# Altium schematic sheet RYA_KiteUp.SchDoc: Kite Up
size A3; Author: PIF.HW Team; DrawnBy: PIF.HW Team; Organization: Pay It Forward club; Address1: 304B1, HCMC; Address2: 268 Ly Thuong Kiet street; Address3: Ward 14, District 10; Address4: Ho Chi Minh city, Vietnam; DocumentNumber: 1; Revision: v1.3; SheetNumber: 1; SheetTotal: 2; ProjectTitle: RYA_KiteUp.PrjPcb
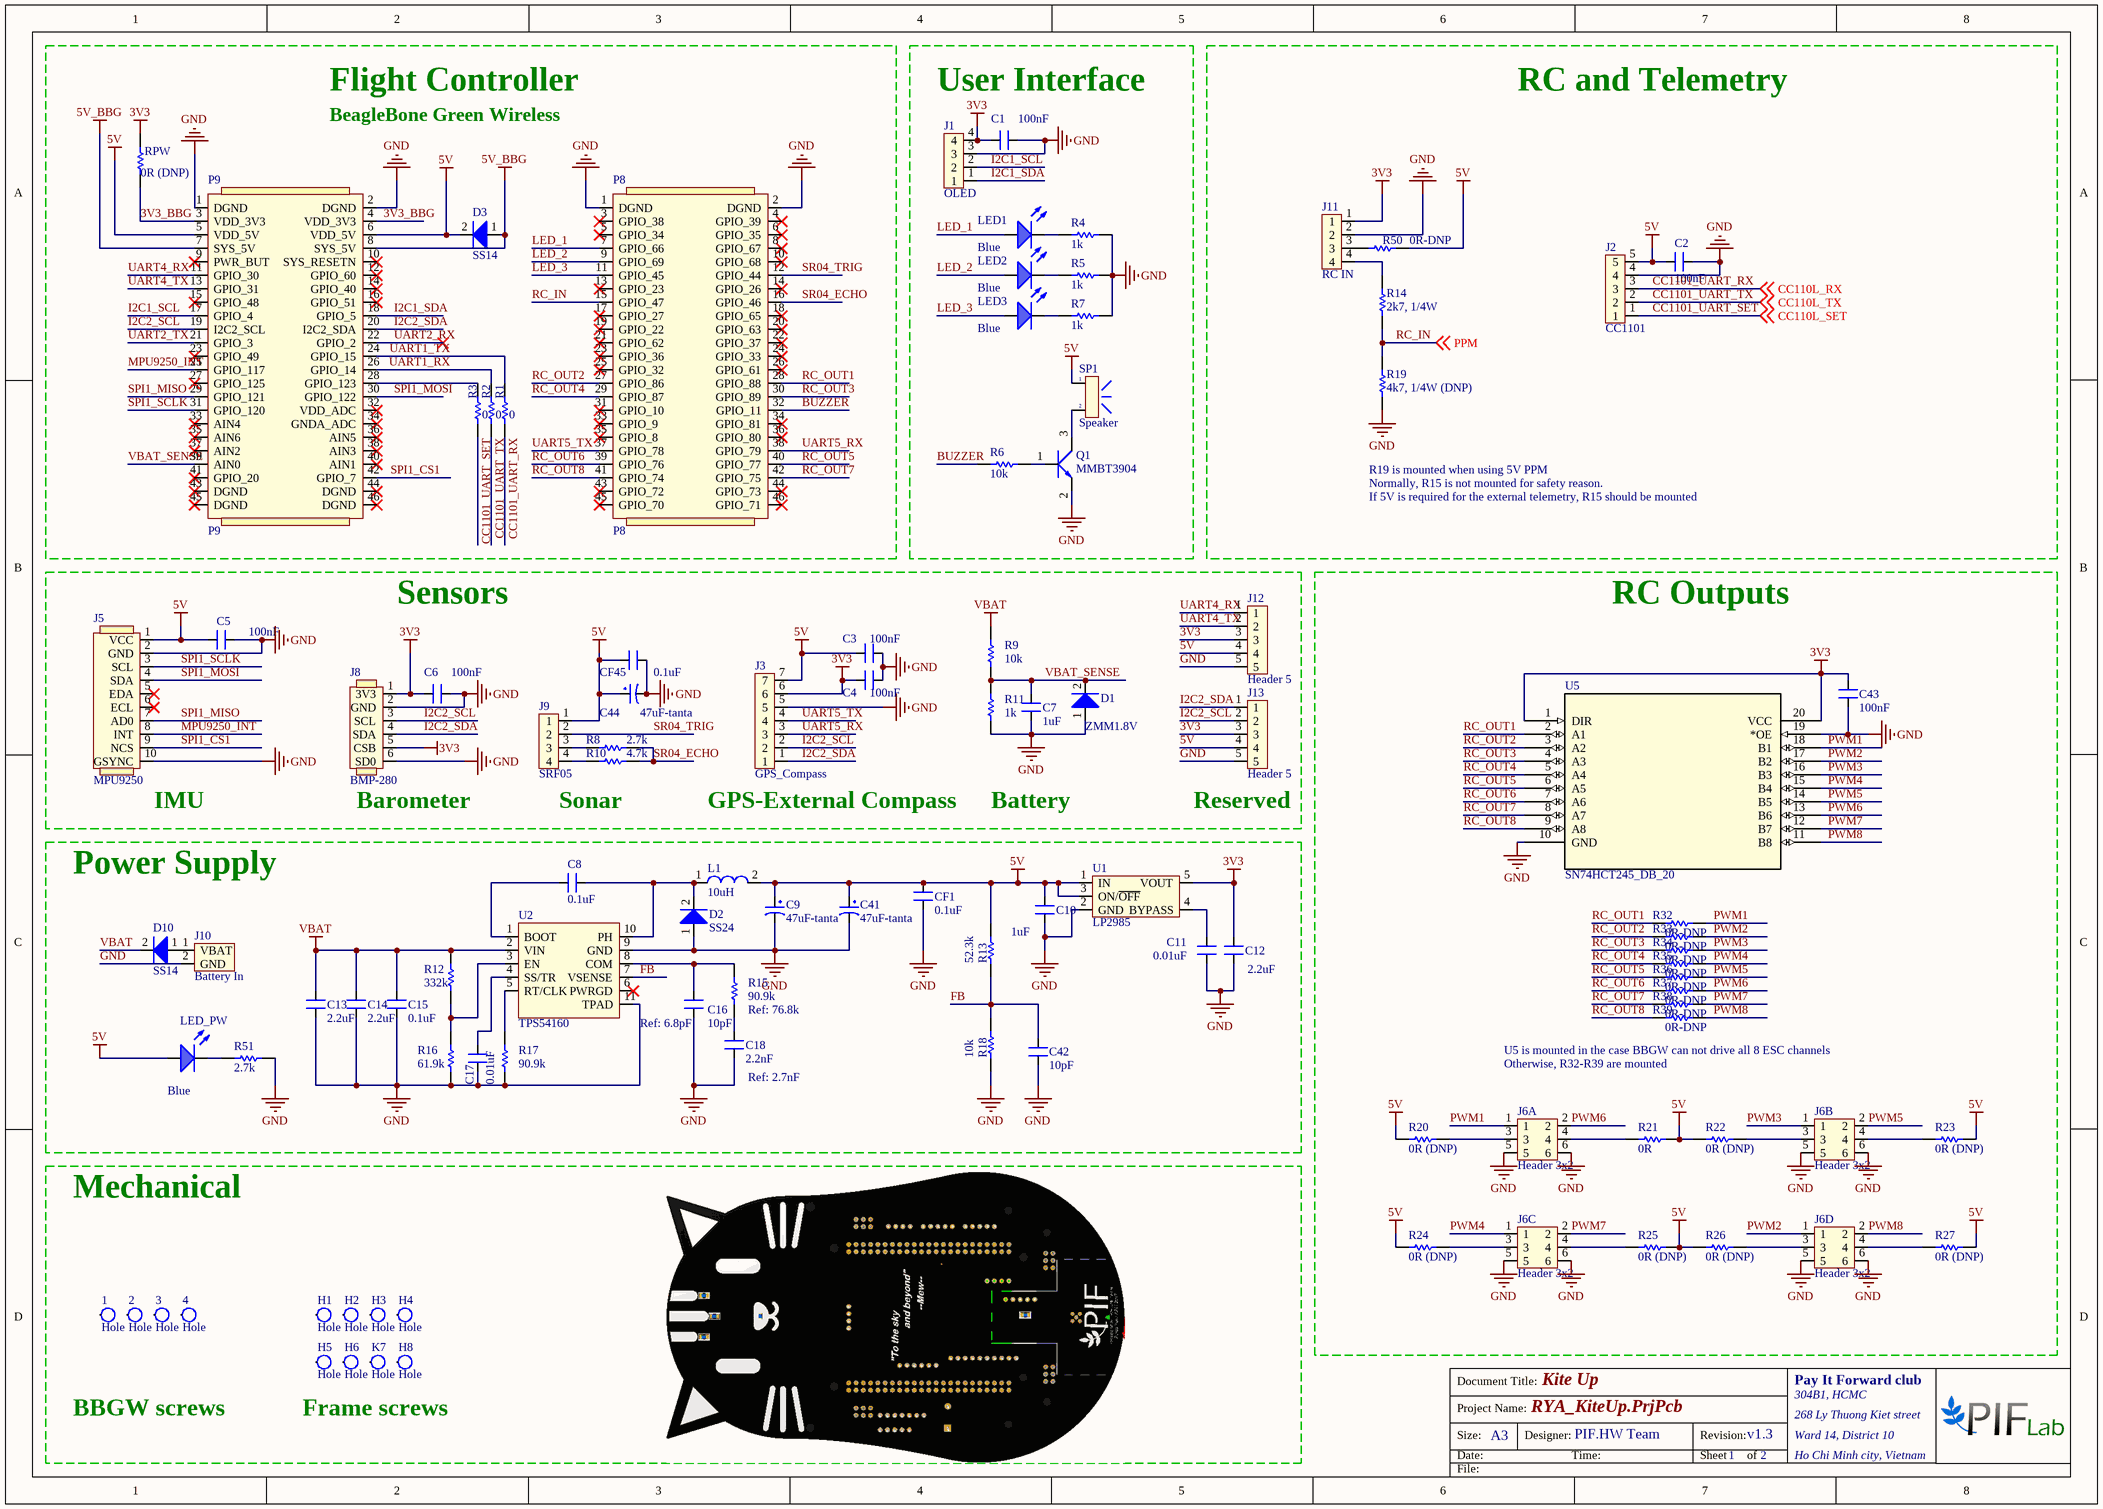
[diagram p0: RYA_KiteUp.SchDoc]

## Parts
1  Hole  [Screw_3.2]  (no BOM)
2  Hole  [Screw_3.2]  (no BOM)
3  Hole  [Screw_3.2]  (no BOM)
4  Hole  [Screw_3.2]  (no BOM)
C1  100nF  [CAP 0603(1508)]  (no BOM)
C2  100nF  [CAP 0603(1508)]  (no BOM)
C3  100nF  [CAP 0603(1508)]  (no BOM)
C4  100nF  [CAP 0603(1508)]  (no BOM)
C5  100nF  [CAP 0603(1508)]
C6  100nF  [CAP 0603(1508)]
C7  1uF  [CAP 0603(1508)]
C8  0.1uF  [CAP 0603(1508)]
C9  47uF-tanta  [CAP_TAN_2312(6032)]
C10  1uF  [CAP 0603(1508)]
C11  0.01uF  [CAP 0603(1508)]
C12  2.2uF  [CAP 0603(1508)]
C13  2.2uF  [CAP 0603(1508)]
C14  2.2uF  [CAP 0603(1508)]
C15  0.1uF  [CAP 0603(1508)]
C16  10pF  [CAP 0603(1508)]
C17  0.01uF  [CAP 0603(1508)]
C18  2.2nF  [CAP 0603(1508)]
C41  47uF-tanta  [CAP_TAN_2312(6032)]  (no BOM)
C42  10pF  [CAP 0603(1508)]  (no BOM)
C43  100nF  [CAP 0603(1508)]
C44  47uF-tanta  [CAP_TAN_2312(6032)]  (no BOM)
CF1  0.1uF  [CAP 0603(1508)]
CF45  0.1uF  [CAP 0603(1508)]
D1  ZMM1.8V  [ZMM1.8V]
D2  SS24  [SS24]
D3  SS14  [SS24]
D10  SS14  [SS24]
H1  Hole  [Screw_3.2]  (no BOM)
H2  Hole  [Screw_3.2]  (no BOM)
H3  Hole  [Screw_3.2]  (no BOM)
H4  Hole  [Screw_3.2]  (no BOM)
H5  Hole  [Screw_3.2]  (no BOM)
H6  Hole  [Screw_3.2]  (no BOM)
H8  Hole  [Screw_3.2]  (no BOM)
J1  OLED  [Header 4]  (no BOM)
J2  CC1101  [Header 5]  (no BOM)
J3  GPS_Compass  [Header 7]  (no BOM)
J5  MPU9250  [Header 10]
J6A  Header 3x2  [Header 3x2]
J6B  Header 3x2  [Header 3x2]
J6C  Header 3x2  [Header 3x2]
J6D  Header 3x2  [Header 3x2]
J8  BMP-280  [Header 6]
J9  SRF05  [Header 4]
J10  Battery In  [BATTERYPAD]
J11  RC IN  [Header 4]  (no BOM)
J12  Header 5  [Header 5]  (no BOM)
J13  Header 5  [Header 5]  (no BOM)
K7  Hole  [Screw_3.2]  (no BOM)
L1  10uH  [Inductor SMD 48x48x28mm]
LED1  value Blue  [LED0805BLUE]  (hidden comment: LED_BLUE)
LED2  value Blue  [LED0805BLUE]  (hidden comment: LED_BLUE)
LED3  value Blue  [LED0805BLUE]  (hidden comment: LED_BLUE)
LED_PW  value Blue  [LED0805BLUE]  (hidden comment: LED_BLUE)
P8  P8  [Header 46]
P9  P9  [Header 46]
Q1  MMBT3904  [MMBT3904]
R1  0  [RES 0603(1508)]  (no BOM)
R2  0  [RES 0603(1508)]  (no BOM)
R3  0  [RES 0603(1508)]  (no BOM)
R4  1k  [RES 0603(1508)]
R5  1k  [RES 0603(1508)]
R6  10k  [RES 0603(1508)]
R7  1k  [RES 0603(1508)]
R8  2.7k  [RES 0603(1508)]
R9  10k  [RES 0603(1508)]
R10  4.7k  [RES 0603(1508)]
R11  1k  [RES 0603(1508)]
R12  332k  [RES 0603(1508)]
R13  52.3k  [RES 0603(1508)]
R14  2k7, 1/4W  [RES 0603(1508)]
R15  90.9k  [RES 0603(1508)]
R16  61.9k  [RES 0603(1508)]
R17  90.9k  [RES 0603(1508)]
R18  10k  [RES 0603(1508)]
R19  4k7, 1/4W (DNP)  [RES 0603(1508)]  (no BOM)
R20  0R (DNP)  [RES 0603(1508)]  (no BOM)
R21  0R  [RES 0603(1508)]  (no BOM)
R22  0R (DNP)  [RES 0603(1508)]  (no BOM)
R23  0R (DNP)  [RES 0603(1508)]  (no BOM)
R24  0R (DNP)  [RES 0603(1508)]  (no BOM)
R25  0R (DNP)  [RES 0603(1508)]  (no BOM)
R26  0R (DNP)  [RES 0603(1508)]  (no BOM)
R27  0R (DNP)  [RES 0603(1508)]  (no BOM)
R32  0R-DNP  [RES 0603(1508)]  (no BOM)
R33  0R-DNP  [RES 0603(1508)]  (no BOM)
R34  0R-DNP  [RES 0603(1508)]  (no BOM)
R35  0R-DNP  [RES 0603(1508)]  (no BOM)
R36  0R-DNP  [RES 0603(1508)]  (no BOM)
R37  0R-DNP  [RES 0603(1508)]  (no BOM)
R38  0R-DNP  [RES 0603(1508)]  (no BOM)
R39  0R-DNP  [RES 0603(1508)]  (no BOM)
R50  0R-DNP  [RES 0603(1508)]  (no BOM)
R51  2.7k  [RES 0603(1508)]
RPW  0R (DNP)  [RES 0603(1508)]  (no BOM)
SP1  Speaker  [Buzzer]
U1  LP2985  [LP2985]
U2  TPS54160  [TPS54160]
U5  SN74HCT245_DB_20  [DW20]

## Blocks framed on the sheet
Flight Controller: D3 P8 P9 R1-R3 RPW
User Interface: C1 J1 LED1-LED3 Q1 R4-R7 SP1
RC and Telemetry: C2 J2 J11 R14 R19 R50
Sensors: C3-C7 C44 CF45 D1 J3 J5 J8 J9 J12 J13 R8-R11
RC Outputs: C43 J6A J6B J6C J6D R20-R27 R32-R39 U5
Power Supply: C8-C18 C41 C42 CF1 D2 D10 J10 L1 LED_PW R12 R13 R15-R18 R51 U1 U2
Mechanical: 1-4 H1-H6 H8 K7

## Nets
3V3: C1.2 C4.2 C6.1 C12.2 C43.2 J1.4 J3.6 J8.1(3V3) J8.5(CSB) J11.1 J12.3 J13.3 RPW.2 U1.5(VOUT) U5.1(DIR) U5.20(VCC)
5V: C2.2 C3.2 C5.1 C9.1 C10.2 C41.1 C44.1 CF1.2 CF45.2 D3.2(K) J2.5 J3.7 J5.1(VCC) J9.1 J12.4 J13.4 L1.2 LED_PW.1(A) P9.5(VDD_5V) P9.6(VDD_5V) R13.1 R20.2 R21.1 R22.2 R23.1 R24.2 R25.1 R26.2 R27.1 R50.2 SP1.1 U1.1(IN) U1.3(ON/~{OFF})
5V_BBG: D3.1(A) P9.7(SYS_5V) P9.8(SYS_5V)
GND: C1.1 C2.1 C3.1 C4.1 C5.2 C6.2 C7.1 C9.2 C10.1 C11.1 C12.1 C13.1 C14.1 C15.1 C16.1 C17.1 C18.1 C41.2 C42.1 C43.1 C44.2 CF1.1 CF45.1 D1.1(A) D2.1(A) J1.3 J2.4 J3.5 J5.2(GND) J5.10(GSYNC) J6A.5 J6A.6 J6B.5 J6B.6 J6C.5 J6C.6 J6D.5 J6D.6 J8.2(GND) J8.6(SD0) J10.2(GND) J11.2 J12.5 J13.5 P8.1(DGND) P8.2(DGND) P9.1(DGND) P9.2(DGND) Q1.2(E) R4.1 R5.1 R7.1 R11.2 R16.2 R17.2 R18.2 R19.2 R51.1 U1.2(GND) U2.9(GND) U2.11(TPAD) U5.10(GND) U5.19(*OE)
VBAT: C13.2 C14.2 C15.2 D10.2(K) R9.1 R12.1 U2.2(VIN)
3V3_BBG: P9.3(VDD_3V3) P9.4(VDD_3V3) RPW.1
BUZZER: P8.32(GPIO_11) R6.2
CC1101_UART_RX: J2.3 R1.1 ; off-sheet CC110L_RX  [also labelled CC110L_RX]
CC1101_UART_SET: J2.1 R3.1 ; off-sheet CC110L_SET  [also labelled CC110L_SET]
CC1101_UART_TX: J2.2 R2.1 ; off-sheet CC110L_TX  [also labelled CC110L_TX]
FB: C42.2 R13.2 R18.1 U2.7(VSENSE)
I2C1_SCL: J1.2 P9.17(GPIO_4)
I2C1_SDA: J1.1 P9.18(GPIO_5)
I2C2_SCL: J3.2 J8.3(SCL) J13.2 P9.19(I2C2_SCL)
I2C2_SDA: J3.1 J8.4(SDA) J13.1 P9.20(I2C2_SDA)
LED_1: LED1.1(A) P8.7(GPIO_66)
LED_2: LED2.1(A) P8.9(GPIO_69)
LED_3: LED3.1(A) P8.11(GPIO_45)
MPU9250_INT: J5.8(INT) P9.25(GPIO_117)
PWM1: J6A.1 R32.1 U5.18(B1)
PWM2: J6D.1 R33.1 U5.17(B2)
PWM3: J6B.1 R34.1 U5.16(B3)
PWM4: J6C.1 R35.1 U5.15(B4)
PWM5: J6B.2 R36.1 U5.14(B5)
PWM6: J6A.2 R37.1 U5.13(B6)
PWM7: J6C.2 R38.1 U5.12(B7)
PWM8: J6D.2 R39.1 U5.11(B8)
RC_IN: P8.15(GPIO_47) R14.2 R19.1 ; off-sheet PPM  [also labelled PPM]
RC_OUT1: P8.28(GPIO_88) R32.2 U5.2(A1)
RC_OUT2: P8.27(GPIO_86) R33.2 U5.3(A2)
RC_OUT3: P8.30(GPIO_89) R34.2 U5.4(A3)
RC_OUT4: P8.29(GPIO_87) R35.2 U5.5(A4)
RC_OUT5: P8.40(GPIO_77) R36.2 U5.6(A5)
RC_OUT6: P8.39(GPIO_76) R37.2 U5.7(A6)
RC_OUT7: P8.42(GPIO_75) R38.2 U5.8(A7)
RC_OUT8: P8.41(GPIO_74) R39.2 U5.9(A8)
SPI1_CS1: J5.9(NCS) P9.42(GPIO_7)
SPI1_MISO: J5.7(AD0) P9.29(GPIO_121)
SPI1_MOSI: J5.4(SDA) P9.30(GPIO_122)
SPI1_SCLK: J5.3(SCL) P9.31(GPIO_120)
SR04_ECHO: P8.16(GPIO_46) R8.1 R10.1
SR04_TRIG: J9.2 P8.12(GPIO_44)
UART1_RX: P9.26(GPIO_14) R2.2
UART1_TX: P9.24(GPIO_15) R1.2
UART2_RX: P9.22(GPIO_2)
UART2_TX: P9.21(GPIO_3)
UART4_RX: J12.1 P9.11(GPIO_30)
UART4_TX: J12.2 P9.13(GPIO_31)
UART5_RX: J3.3 P8.38(GPIO_79)
UART5_TX: J3.4 P8.37(GPIO_78)
VBAT_SENSE: C7.2 D1.2(K) P9.39(AIN0) R9.2 R11.1
NetC8_1: C8.1 U2.1(BOOT)
NetC8_2: C8.2 D2.2(K) L1.1 U2.10(PH)
NetC11_2: C11.2 U1.4(BYPASS)
NetC16_2: C16.2 R15.1 U2.8(COM)
NetC17_2: C17.2 U2.4(SS/TR)
NetC18_2: C18.2 R15.2
NetD10_1: D10.1(A) J10.1(VBAT)
NetJ6A_3: J6A.3 R20.1
NetJ6A_4: J6A.4 R21.2
NetJ6B_3: J6B.3 R22.1
NetJ6B_4: J6B.4 R23.2
NetJ6C_3: J6C.3 R24.1
NetJ6C_4: J6C.4 R25.2
NetJ6D_3: J6D.3 R26.1
NetJ6D_4: J6D.4 R27.2
NetJ9_3: J9.3 R8.2
NetJ9_4: J9.4 R10.2
NetJ11_3: J11.3 R50.1
NetJ11_4: J11.4 R14.1
NetLED1_2: LED1.2(K) R4.2
NetLED2_2: LED2.2(K) R5.2
NetLED3_2: LED3.2(K) R7.2
NetLED_PW_2: LED_PW.2(K) R51.2
NetP9_28: P9.28(GPIO_123) R3.2
NetQ1_1: Q1.1(B) R6.1
NetQ1_3: Q1.3(C) SP1.2
NetR12_2: R12.2 R16.1 U2.3(EN)
NetR17_1: R17.1 U2.5(RT/CLK)

Not connected (* = marked no-connect by the designer): 1 1; 2 1; 3 1; 4 1; H1 1; H2 1; H3 1; H4 1; H5 1; H6 1; H8 1; J5 5(EDA)* 6(ECL)*; K7 1; P8 3(GPIO_38)* 4(GPIO_39)* 5(GPIO_34)* 6(GPIO_35)* 8(GPIO_67)* 10(GPIO_68)* 13(GPIO_23)* 14(GPIO_26)* 17(GPIO_27)* 18(GPIO_65)* 19(GPIO_22)* 20(GPIO_63)* 21(GPIO_62)* 22(GPIO_37)* 23(GPIO_36)* 24(GPIO_33)* 25(GPIO_32)* 26(GPIO_61)* 31(GPIO_10)* 33(GPIO_9)* 34(GPIO_81)* 35(GPIO_8)* 36(GPIO_80)* 43(GPIO_72)* 44(GPIO_73)* 45(GPIO_70)* 46(GPIO_71)*; P9 9(PWR_BUT)* 10(SYS_RESETN)* 12(GPIO_60)* 14(GPIO_40)* 15(GPIO_48)* 16(GPIO_51)* 23(GPIO_49)* 27(GPIO_125)* 32(VDD_ADC)* 33(AIN4)* 34(GNDA_ADC)* 35(AIN6)* 36(AIN5)* 37(AIN2)* 38(AIN3)* 40(AIN1)* 41(GPIO_20)* 43(DGND)* 44(DGND)* 45(DGND)* 46(DGND)*; U2 6(PWRGD)*

## Notes on the sheet
- BeagleBone Green Wireless
- R19 is mounted when using 5V PPM
- Normally, R15 is not mounted for safety reason.
- If 5V is required for the external telemetry, R15 should be mounted
- (near J5) IMU
- (near J8) Barometer
- Sonar
- (near J3) GPS-External Compass
- Battery
- (near J13) Reserved
- (near C16) Ref: 6.8pF
- (near R15) Ref: 76.8k
- U5 is mounted in the case BBGW can not drive all 8 ESC channels
- (near C18) Ref: 2.7nF
- Otherwise, R32-R39 are mounted
- BBGW screws
- Frame screws
- Document Title:
- Size:
- Date:
- Project Name:
- A3
- Designer:
- Time:
- Revision:
- Sheet
- of
- File:

## Library data of the parts
C1-C8 C10-C18 C42 C43 CF1 CF45 = CAP_NONPOL: Ceramic capacitor
  C1-C6 C8 C15 C43 CF1 CF45: Link: http://tme.vn/Product.aspx?id=739#page=pro_info
  C7 C10: Link: http://tme.vn/Product.aspx?id=728#page=pro_info
  C11 C17: Link: http://tme.vn/Product.aspx?id=738#page=pro_info
  C12: Link: https://www.digikey.com/product-detail/en/samsung-electro-mechanics-america-inc/CL10B225KP8NNNC/1276-1134-1-ND/3889220
  C13 C14: Link: http://tme.vn/Product.aspx?id=422#page=pro_info
  C16 C42: Link: http://tme.vn/Product.aspx?id=1303#page=pro_info
  C18: Link: http://tme.vn/Product.aspx?id=1310#page=pro_info
C9 C41 C44 = CAP_TANTA_47uF_16V_POL: Tantalum SMD capacitor 47uF(+-10%),TAJC476K010RNJ
  C9 C41: Link: http://tme.vn/Product.aspx?id=304#page=pro_info
D3 D10 = SS24: Link: http://tme.vn/Product.aspx?id=639#page=pro_info
J1 J9 J11 = Header 4
J2 = Header 5
J3 = Header 7
J10 = VBATHEADER
L1 = Inductor: Link: http://tme.vn/Product.aspx?id=1640#page=pro_info
LED1-LED3 LED_PW = LED_BLUE: LED Blue; ComponentLink1Description: Datasheet; ComponentLink1URL: D:\Dropbox\Datasheets\Opto and Illumination\LEDs\SMD LED.pdf; Unit Price: 0.0476
  LED1-LED3: Link: http://tme.vn/Product.aspx?id=2014#page=pro_info
  LED_PW: Link: http://tme.vn/Product.aspx?id=2016#page=pro_info
R1-R27 R32-R39 R50 R51 RPW = Res 1/4W: Resistor through hole 1/4W
  R4 R5 R7 R11: Link: http://tme.vn/Product.aspx?id=711#page=pro_info
  R6 R9 R18: Link: http://tme.vn/Product.aspx?id=712#page=pro_info
  R8 R14 R51: Link: http://tme.vn/Product.aspx?id=737#page=pro_info
  R10: Link: http://tme.vn/Product.aspx?id=722#page=pro_info
  R12: Link: https://www.digikey.com/product-detail/en/yageo/RC0603FR-07332KL/311-332KHRCT-ND/730112
  R13: Link: https://www.digikey.com/product-detail/en/yageo/RC0603FR-0752K3L/311-52.3KHRCT-ND/730237
  R15 R17: Link: https://www.digikey.com/product-detail/en/yageo/RC0603FR-0790K9L/311-90.9KHRCT-ND/730371
  R16: Link: https://www.digikey.com/product-detail/en/yageo/RC0603FR-0761K9L/311-61.9KHRCT-ND/730279
SP1 = Speaker: Buzzer through hole (3V3/5V/12V); Link: http://tme.vn/Product.aspx?id=1112#page=pro_info
U5 = SN74HCT245_DB_20: Imported; Manufacturer: Texas Instruments; INDUSTRY_STD_PKG_TYPE: SSOP; FAMILY_NAME: STANDARD TRANSCEIVER; PIN_COUNT: 20; PACKAGE_DESIGNATOR: DB; Datasheet_URL: http://www.ti.com/lit/gpn/SN74HCT245; GENERIC_PART_NUMBER: SN74HCT245; Vendor: Texas Instruments; Manufacturer_Part_Number: sn74hct245_db_20; Value: Value; Type: Type; RefDes: RefDes; Link: http://tme.vn/Product.aspx?id=500#page=pro_info
D1 = ZMM1.8V: Link: https://www.digikey.com/product-detail/en/vishay-semiconductor-diodes-division/TZS4678-GS08/TZS4678-GS08CT-ND/3104522
D2 = SS24: Link: http://tme.vn/Product.aspx?id=1408#page=pro_info
Q1 = MMBT3904: Link: http://tme.vn/Product.aspx?id=415#page=pro_info